# EAGLE design Teensy MouseV2.0_top_Deck (EAGLE 6.5.0)
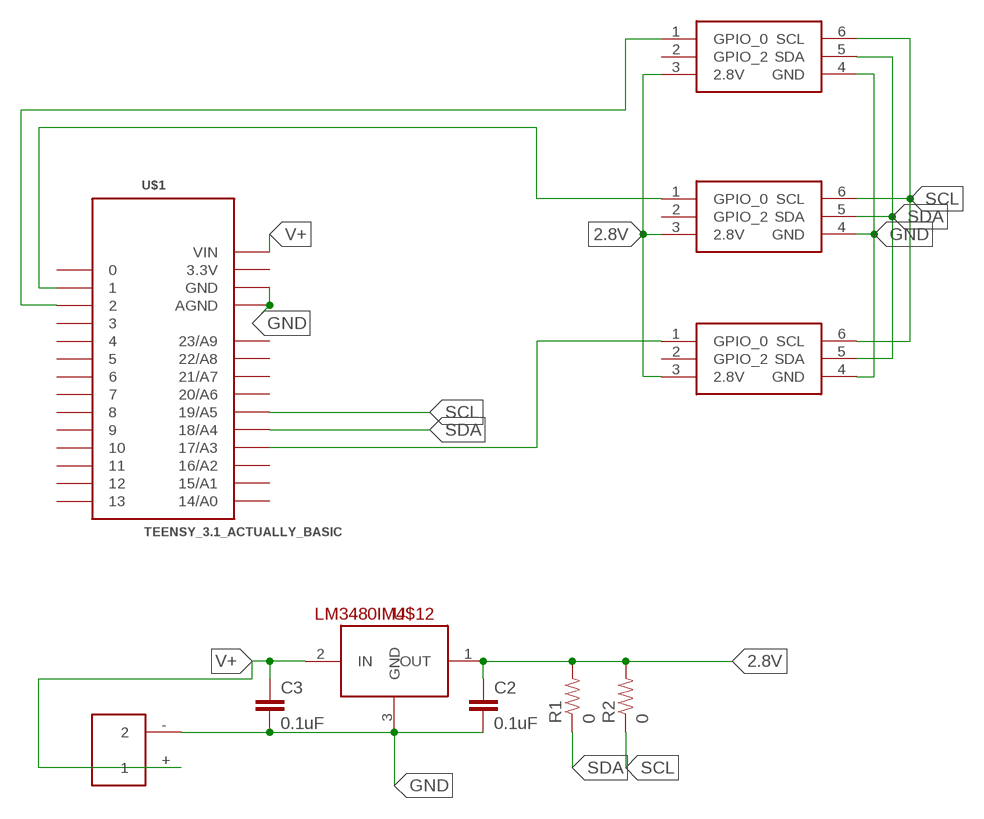
[diagram p0: schematic, sheet 1]

## Parts
C2  0.1uF  0.1UF-25V(+80/-20%)(0603)  [0603-CAP]
C3  0.1uF  0.1UF-25V(+80/-20%)(0603)  [0603-CAP]
R1  0  0OHM1/10W5%(0603)  [0603]
R2  0  0OHM1/10W5%(0603)  [0603]
U$1  TEENSY_3.1_ACTUALLY_BASIC  [TEENSY_3.0_ACTUALLY_BASIC]
U$2  PICOBLADE2X  [PICOBLADE2X]
U$9  PATRICK'S_ST_SENSOR_BOARD  [2X3HEADER]
U$10  PATRICK'S_ST_SENSOR_BOARD  [2X3HEADER]
U$11  PATRICK'S_ST_SENSOR_BOARD  [2X3HEADER]
U$12  LM3480IM4  [SOT23-3]

## Nets
2.8V: C2.1 R1.2 R2.2 U$9.3(2.8V) U$10.3(2.8V) U$11.3(2.8V) U$12.1(OUT)
GND: C2.2 C3.2 U$1.AGND U$1.GND U$2.- U$9.4(GND) U$10.4(GND) U$11.4(GND) U$12.3(GND)
N$1: U$1.17/A3 U$11.1(GPIO_0)
N$2: U$1.1 U$10.1(GPIO_0)
N$3: U$1.2 U$9.1(GPIO_0)
SCL: R2.1 U$1.19/A5 U$9.6(SCL) U$10.6(SCL) U$11.6(SCL)
SDA: R1.1 U$1.18/A4 U$9.5(SDA) U$10.5(SDA) U$11.5(SDA)
V+: C3.1 U$1.VIN U$2.+ U$12.2(IN)
Unconnected: U$1.0 U$1.3 U$1.4 U$1.5 U$1.6 U$1.7 U$1.8 U$1.9 U$1.10 U$1.11 U$1.12 U$1.13 U$1.14/A0 U$1.15/A1 U$1.16/A2 U$1.20/A6 U$1.21/A7 U$1.22/A8 U$1.23/A9 U$9.2(GPIO_2) U$10.2(GPIO_2) U$11.2(GPIO_2)

## Power pins joined to a net without a drawn wire
3.3V: U$1.3.3V

## Library data of the parts
C2 C3 = SparkFun-Capacitors:0.1UF-25V(+80/-20%)(0603): CAP-00810 Ceramic Standard decoupling cap; PROD_ID: CAP-00810
R1 R2 = SparkFun-Resistors:0OHM1/10W5%(0603): RES-08609; PROD_ID: RES-08609
U$1 = Teensy3.0:TEENSY_3.1_ACTUALLY_BASIC
U$2 = 11Nick'sCustom:PICOBLADE2X
U$9-U$11 = 11Nick'sCustom:PATRICK'S_ST_SENSOR_BOARD
U$12 = SparkFun-PowerIC:LM3480IM4: Small package linear regulator

## Board
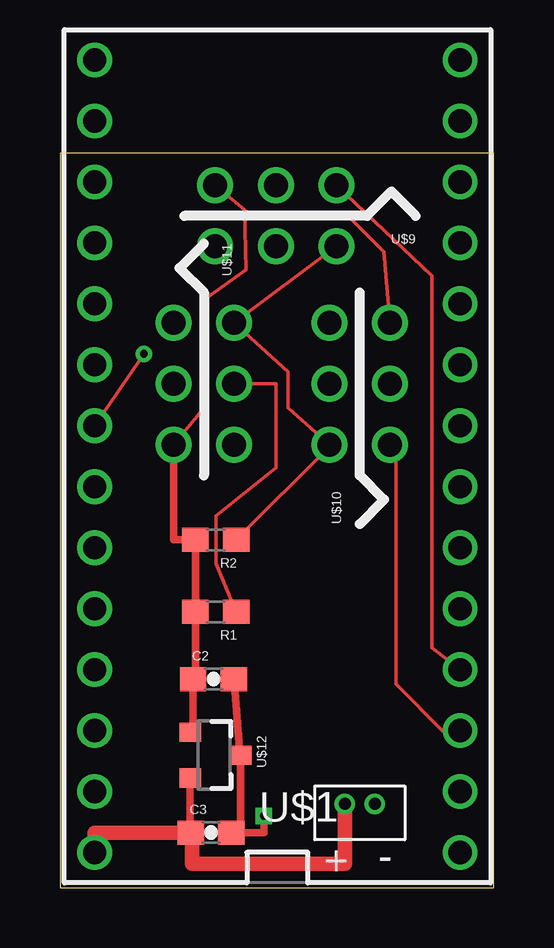
[diagram p1: board, top side]
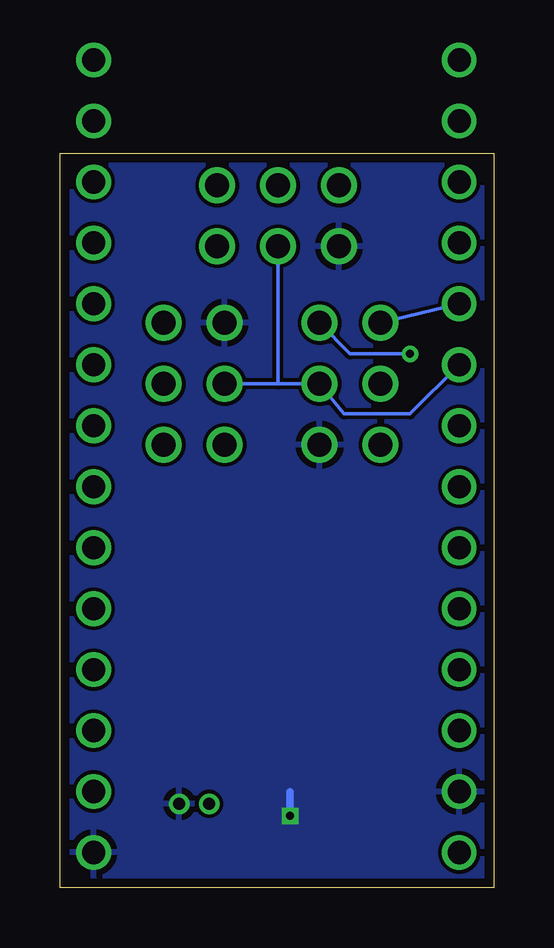
[diagram p2: board, bottom side, seen from below]

Size 18.1 x 30.6 mm. Coordinates in mm from the lower left corner, seen from the top.
Outline: 0,0 18.1,0 18.1,30.6 0,30.6 0,0
Copper layers (1*16): Top 0.0356mm / dielectric 1.5011mm / Bottom 0.0356mm
Design rules "LaenPCBOrder": minimum track width 6mil, minimum drill 13mil, track to track 6mil, track to pad 6mil, pad to pad 6mil, via to via 6mil, smd to smd 6mil, copper to edge 15mil, drill to drill 6mil, minimum pad ring 7mil, minimum via ring 7mil, stop-mask expansion 3mil, vias tented up to drill 0mil, thermal gap 10mil

### Footprints (pad centres in the part's own frame; a part is rotated, then mirrored left to right if it is on the bottom)
0603-CAP = smd 1.1 x 1: 1 -0.85,0; 2 0.85,0
0603 = smd 1.1 x 1: 1 -0.85,0; 2 0.85,0
TEENSY_3.0_ACTUALLY_BASIC = drill 0.965: 0 -5.08,7.62; 1 -5.08,5.08; 2 -5.08,2.54; 3 -5.08,0; 3.3V 10.16,5.08; 4 -5.08,-2.54; 5 -5.08,-5.08; 6 -5.08,-7.62; 7 -5.08,-10.16; 8 -5.08,-12.7; 9 -5.08,-15.24; 10 -5.08,-17.78; 11 -5.08,-20.32; 12 -5.08,-22.86; 13 10.16,-22.86; 14/A0 10.16,-20.32; 15/A1 10.16,-17.78; 16/A2 10.16,-15.24; 17/A3 10.16,-12.7; 18/A4 10.16,-10.16; 19/A5 10.16,-7.62; 20/A6 10.16,-5.08; 21/A7 10.16,-2.54; 22/A8 10.16,0; 23/A9 10.16,2.54; AGND 10.16,7.62; GND -5.08,10.16; VIN 10.16,10.16
PICOBLADE2X = drill 0.5: + -0.625,0; - 0.625,0
2X3HEADER = drill 1: 1 -2.54,-1.27; 2 0,-1.27; 3 2.54,-1.27; 4 2.54,1.27; 5 0,1.27; 6 -2.54,1.27
SOT23-3 = smd 0.8 x 0.9: 1 -0.95,-1; 2 0.95,-1; 3 0,1.1

### Placement (x,y rotation side)
C2  6.4,8.7 0 top
C3  6.3,2.3 0 top
R1  6.5,11.5 180 top
R2  6.5,14.5 180 top
U$1  11.61,11.63 180 top
U$2  12.5,3.5 0 top
U$9  9,28 180 top
U$10  12.5,21 90 top
U$11  6,21 270 top
U$12  6.43,5.53 270 top

### Tracks (layer width: path | path; a pad name or v marks a point on that pad's centre or on a via)
2.8V
  Top 0.152: U$9.3 7.7,28.25 | 7.7,28.25 8,28 12,28 13.5,26.5 U$10.3 | U$11.3 6,20 6,24.5 7.75,25.75 7.7,28.25
  Top 0.305: U$12.1 5.55,6.48 C2.1 5.65,8.7 R1.2 R2.2 4.73,14.5 U$11.3
GND  (via drill 0.33)
  Top 0.305: C2.2 7.5,5.53 U$12.3 7.53,2.3 C3.2 8.5,2.3 v8.5,3
  Bottom 0.305: v8.5,3 8.5,4
  pour Bottom: 0,30.8 18.3,31.2 18.3,-0.4 -0.2,-0.3
N$1
  Bottom 0.152: U$11.1 U$1.17/A3
N$2
  Top 0.152: U$1.1 15.95,6.55 14,8.5 14,18.23 U$10.1
N$3
  Top 0.152: U$1.2 15.5,10 15.5,25.5 U$9.1
SCL  (via drill 0.33)
  Top 0.152: R2.1 11.23,18.38 U$10.6 9.5,20 9.5,21.5 U$11.6 U$9.6 | U$1.19/A5 v3.5,22.25
  Bottom 0.152: v3.5,22.25 6,22.25 U$11.6
SDA
  Top 0.152: R1.1 6.5,13.5 6.5,15.5 9,17.5 9,21 U$11.5
  Bottom 0.152: 9,21 U$10.5 | 9,21 U$11.5 6.25,19.75 3.5,19.75 U$1.18/A4 | 9,21 U$9.5
V+
  Top 0.305: U$12.2 5.43,2.3 C3.1 5.5,2.3
  Top 0.61: C3.1 1.45,2.3 U$1.VIN | 5.5,2.3 5.5,1 11.88,1 U$2.+